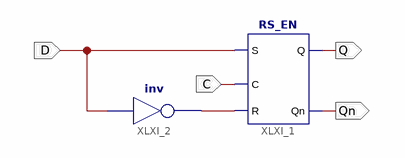
[diagram p0: schematic sheet 1]
// Xilinx ISE schematic D_EN.sch (kintex7) as structural Verilog: 2 symbols, 4 ports
module D_EN (
  input  D,
  input  C,
  output Q,
  output Qn
);

  wire XLXN_3;

  RS_EN XLXI_1 (.Q(Q), .Qn(Qn), .C(C), .S(D), .R(XLXN_3));
  not XLXI_2 (XLXN_3, D);
endmodule
